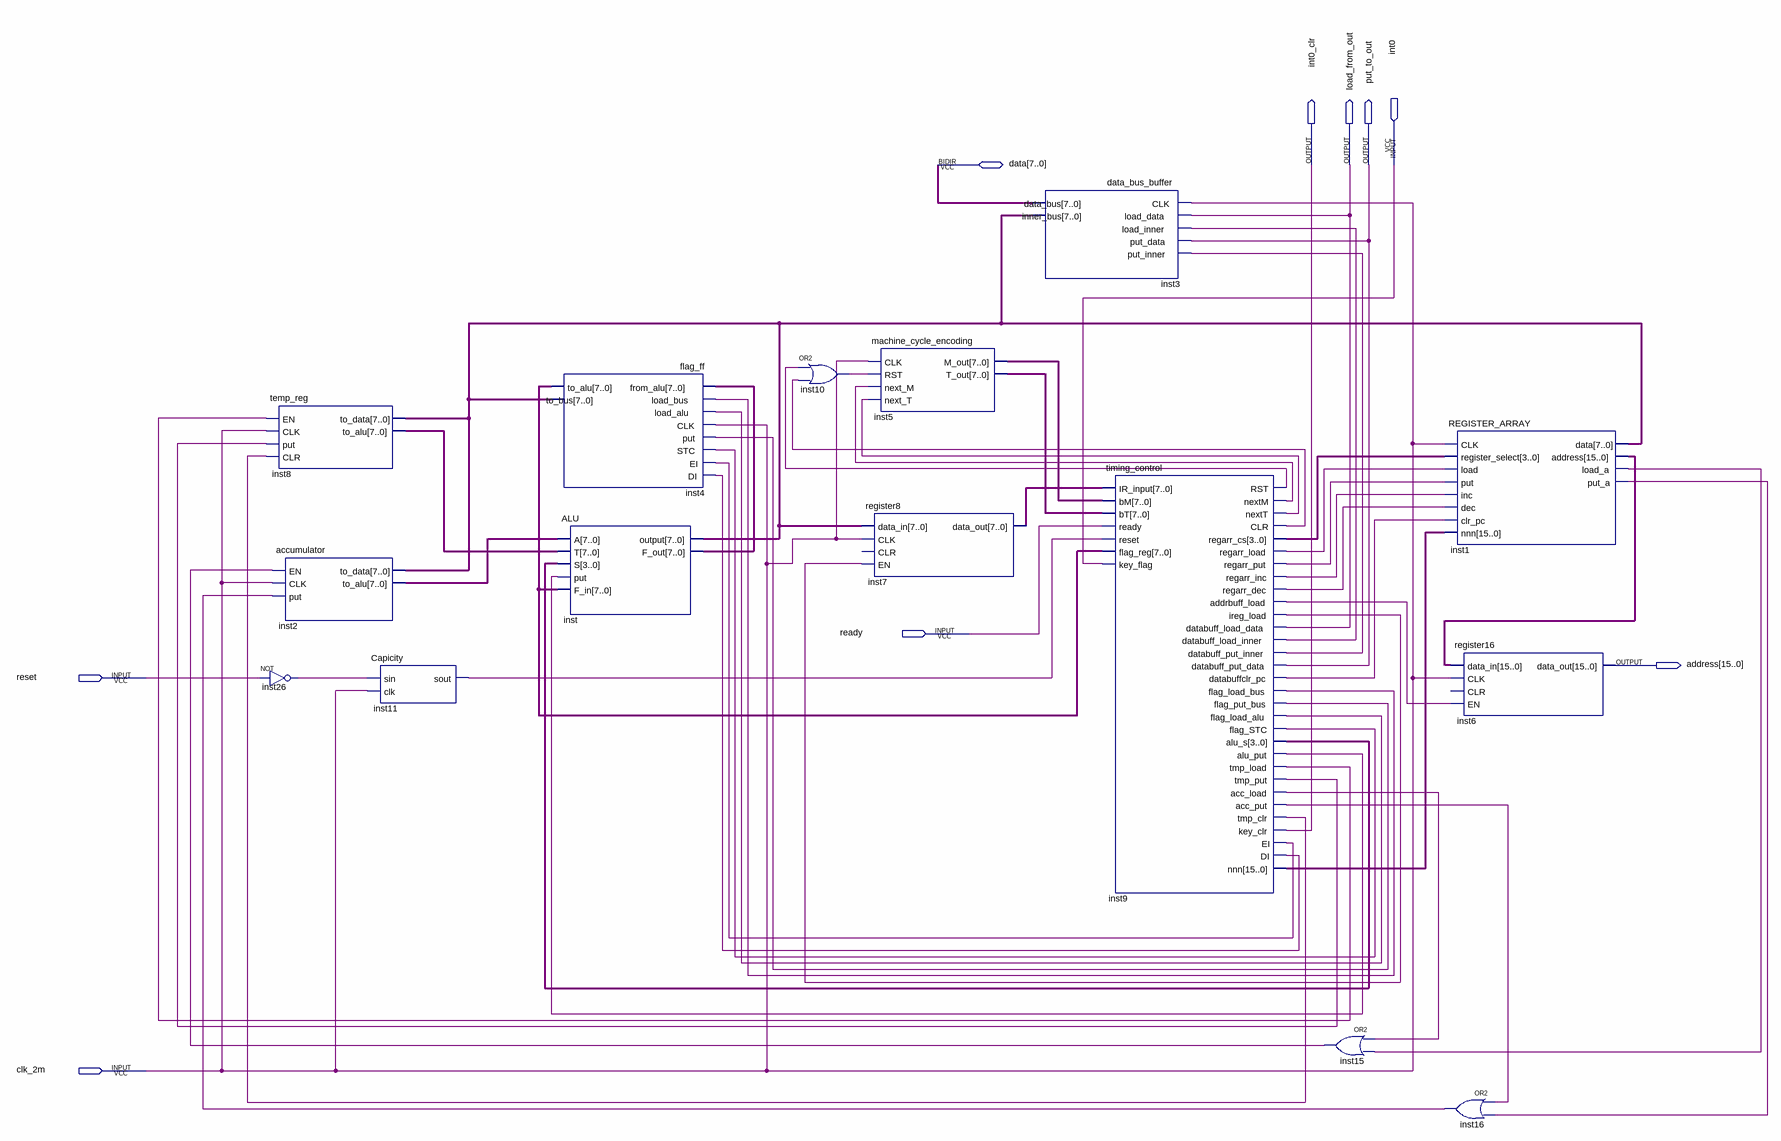
[diagram p0: schematic sheet]
// Quartus schematic CPU.bdf as structural Verilog: 15 symbols, 9 pins
module CPU (
  input  int0,
  input  ready,
  input  reset,
  input  clk_2m,
  inout  [7:0] data,
  output int0_clr,
  output load_from_out,
  output put_to_out,
  output [15:0] address
);

  wire inst1_load_a, inst1_put_a, inst9_acc_load, inst9_acc_put, inst9_addrbuff_load, inst9_alu_put,
       inst9_clr, inst9_databuff_load_inner, inst9_databuff_put_inner, inst9_databuffclr_pc, inst9_di,
       inst9_ei, inst9_flag_load_alu, inst9_flag_load_bus, inst9_flag_put_bus, inst9_flag_stc,
       inst9_ireg_load, inst9_nextm, inst9_nextt, inst9_regarr_dec, inst9_regarr_inc, inst9_regarr_load,
       inst9_regarr_put, inst9_rst, inst9_tmp_clr, inst9_tmp_load, inst9_tmp_put, inst10_out, inst11_sout,
       inst15_out, inst16_out, inst26_out;
  wire [3:0] inst9_alu_s, inst9_regarr_cs;
  wire [7:0] inst2_to_alu, inst4_to_alu, inst5_m_out, inst5_t_out, inst7_data_out, inst8_to_alu,
       inst8_to_data, inst_f_out;
  wire [15:0] inst1_address, inst9_nnn;

  temp_reg inst8 (
    .EN(inst9_tmp_load), .CLK(clk_2m), .put(inst9_tmp_put), .CLR(inst9_tmp_clr), .to_alu(inst8_to_alu),
    .to_data(inst8_to_data));
  accumulator inst2 (.EN(inst15_out), .CLK(clk_2m), .put(inst16_out), .to_alu(inst2_to_alu), .to_data(inst8_to_data));
  not inst26 (inst26_out, reset);
  Capicity inst11 (.sin(inst26_out), .clk(clk_2m), .sout(inst11_sout));
  flag_ff inst4 (
    .from_alu(inst_f_out), .load_bus(inst9_flag_load_bus), .load_alu(inst9_flag_load_alu), .CLK(clk_2m),
    .put(inst9_flag_put_bus), .STC(inst9_flag_stc), .EI(inst9_ei), .DI(inst9_di), .to_alu(inst4_to_alu),
    .to_bus(inst8_to_data));
  ALU inst (
    .A(inst2_to_alu), .T(inst8_to_alu), .S(inst9_alu_s), .put(inst9_alu_put), .F_in(inst4_to_alu),
    .\output (inst8_to_data), .F_out(inst_f_out));
  or inst10 (inst10_out, inst9_rst, inst9_clr);
  machine_cycle_encoding inst5 (
    .CLK(clk_2m), .RST(inst10_out), .next_M(inst9_nextm), .next_T(inst9_nextt), .M_out(inst5_m_out),
    .T_out(inst5_t_out));
  register8 inst7 (
    .data_in(inst8_to_data), .CLK(clk_2m), .EN(inst9_ireg_load), .data_out(inst7_data_out));  // open: CLR
  data_bus_buffer inst3 (
    .CLK(clk_2m), .load_data(load_from_out), .load_inner(inst9_databuff_load_inner), .put_data(put_to_out),
    .put_inner(inst9_databuff_put_inner), .data_bus(data), .inner_bus(inst8_to_data));
  timing_control inst9 (
    .IR_input(inst7_data_out), .bM(inst5_m_out), .bT(inst5_t_out), .ready(ready), .reset(inst11_sout),
    .flag_reg(inst4_to_alu), .key_flag(int0), .RST(inst9_rst), .nextM(inst9_nextm), .nextT(inst9_nextt),
    .CLR(inst9_clr), .regarr_cs(inst9_regarr_cs), .regarr_load(inst9_regarr_load),
    .regarr_put(inst9_regarr_put), .regarr_inc(inst9_regarr_inc), .regarr_dec(inst9_regarr_dec),
    .addrbuff_load(inst9_addrbuff_load), .ireg_load(inst9_ireg_load), .databuff_load_data(load_from_out),
    .databuff_load_inner(inst9_databuff_load_inner), .databuff_put_inner(inst9_databuff_put_inner),
    .databuff_put_data(put_to_out), .databuffclr_pc(inst9_databuffclr_pc),
    .flag_load_bus(inst9_flag_load_bus), .flag_put_bus(inst9_flag_put_bus),
    .flag_load_alu(inst9_flag_load_alu), .flag_STC(inst9_flag_stc), .alu_s(inst9_alu_s),
    .alu_put(inst9_alu_put), .tmp_load(inst9_tmp_load), .tmp_put(inst9_tmp_put), .acc_load(inst9_acc_load),
    .acc_put(inst9_acc_put), .tmp_clr(inst9_tmp_clr), .key_clr(int0_clr), .EI(inst9_ei), .DI(inst9_di),
    .nnn(inst9_nnn));
  or inst15 (inst15_out, inst9_acc_load, inst1_load_a);
  REGISTER_ARRAY inst1 (
    .CLK(clk_2m), .register_select(inst9_regarr_cs), .load(inst9_regarr_load), .put(inst9_regarr_put),
    .inc(inst9_regarr_inc), .dec(inst9_regarr_dec), .clr_pc(inst9_databuffclr_pc), .nnn(inst9_nnn),
    .address(inst1_address), .load_a(inst1_load_a), .put_a(inst1_put_a), .data(inst8_to_data));
  register16 inst6 (.data_in(inst1_address), .CLK(clk_2m), .EN(inst9_addrbuff_load), .data_out(address));  // open: CLR
  or inst16 (inst16_out, inst9_acc_put, inst1_put_a);
endmodule
